# EAGLE design Digital_Output_C (EAGLE 9.5.1)
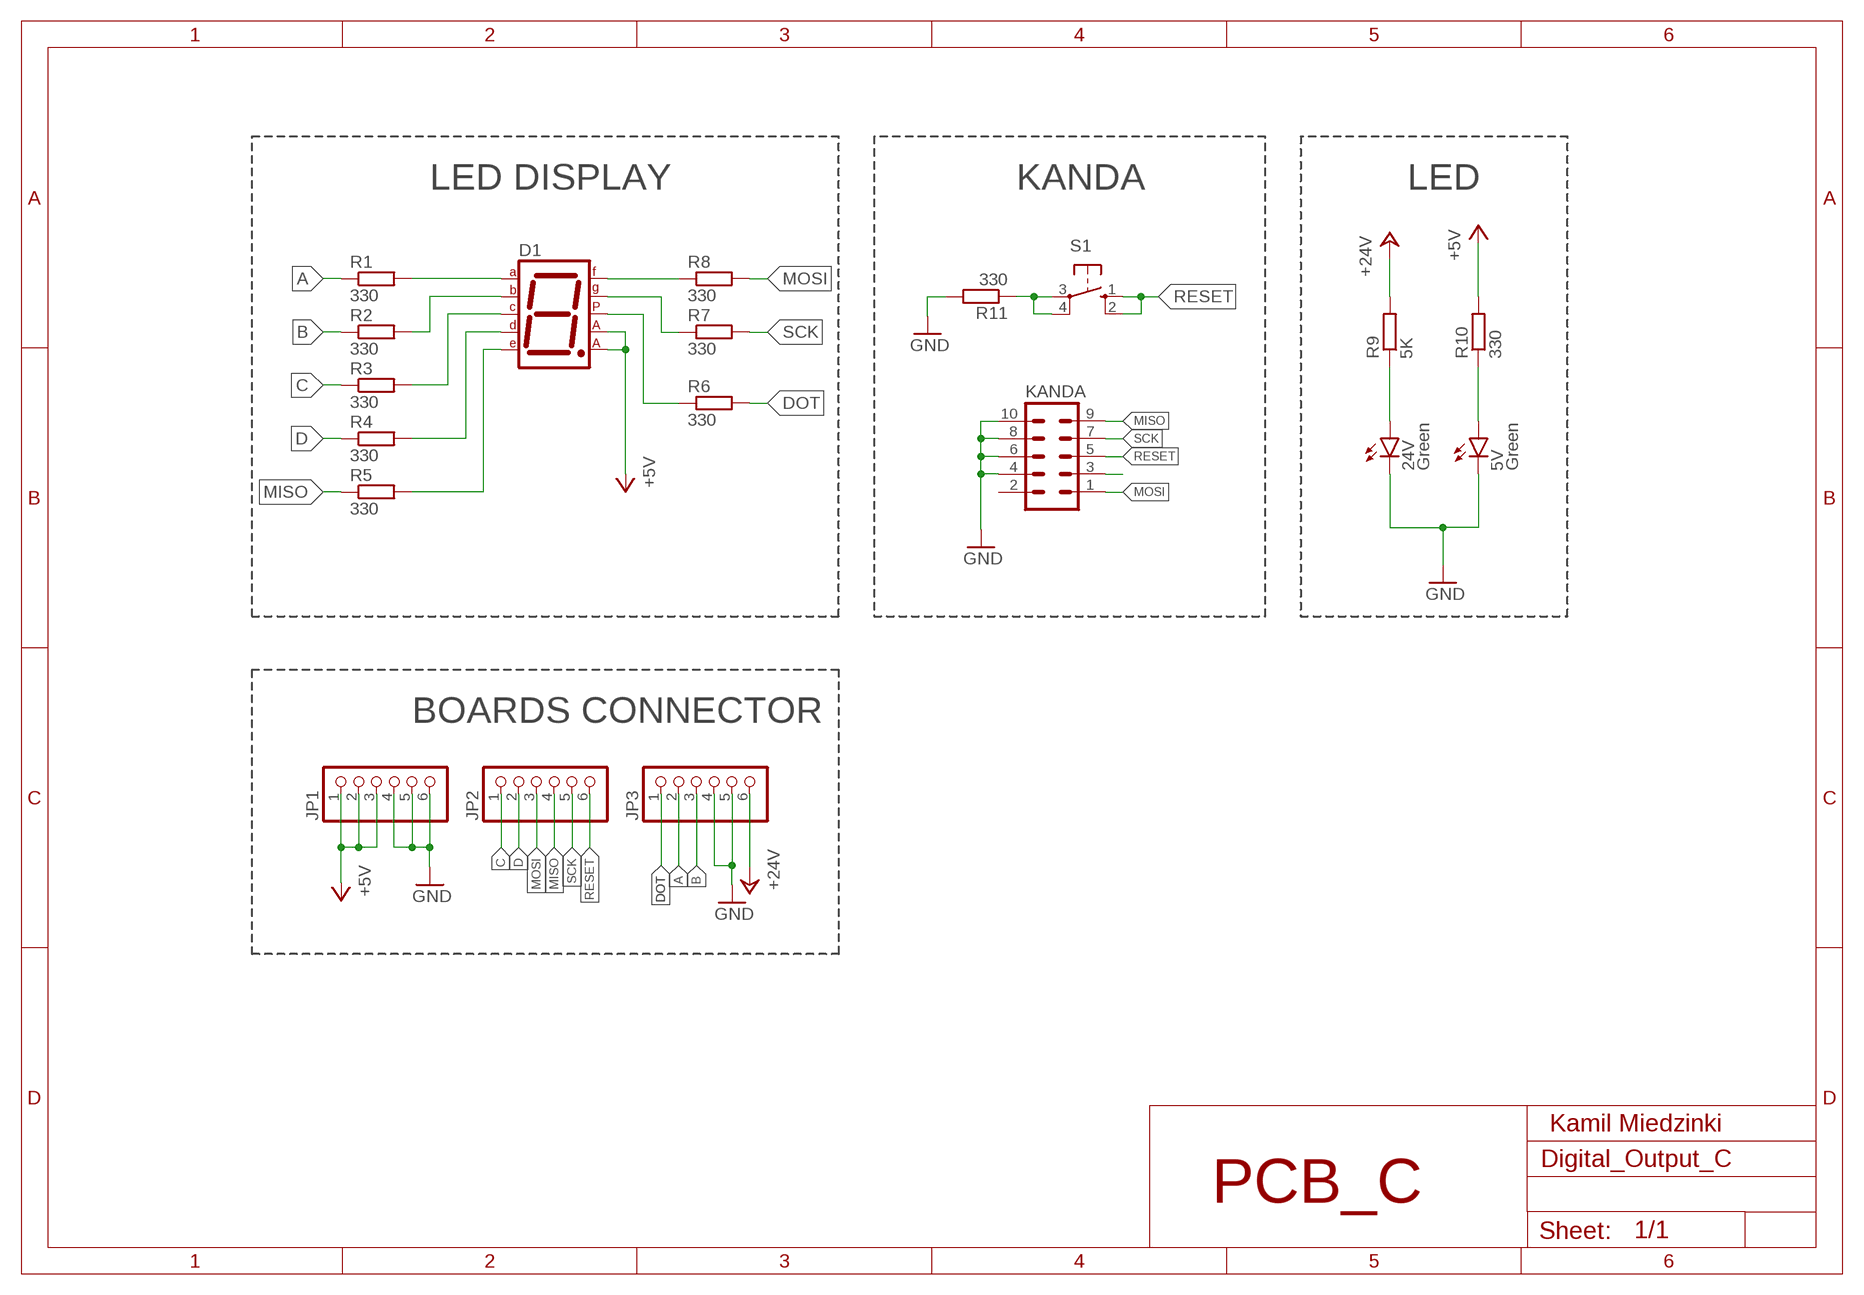
[diagram p0: schematic, sheet 1]

## Parts
5V  Green  LED5MM  [LED5MM]
24V  Green  LED5MM  [LED5MM]
D1  7SEG-CA  [7SEG-13]
JP1  PINHD-1X6"  [1X06H]
JP2  PINHD-1X6"  [1X06H]
JP3  PINHD-1X6"  [1X06H]
KANDA  ML10  [ML10]
R1  330  R-EU_R0805  [R0805]
R2  330  R-EU_R0805  [R0805]
R3  330  R-EU_R0805  [R0805]
R4  330  R-EU_R0805  [R0805]
R5  330  R-EU_R0805  [R0805]
R6  330  R-EU_R0805  [R0805]
R7  330  R-EU_R0805  [R0805]
R8  330  R-EU_R0805  [R0805]
R9  5K  R-EU_0207/7  [0207/7]
R10  330  R-EU_0207/7  [0207/7]
R11  330  R-EU_R0805  [R0805]
S1  10-XX  [B3F-10XX]

## Nets
+5V: D1.3(CA1) D1.8(CA2) JP1.1 JP1.2 JP1.3 R10.2
+24V: JP3.6 R9.2
A: JP3.2 R1.1
B: JP3.3 R2.1
C: JP2.1 R3.1
D: JP2.2 R4.1
DOT: JP3.1 R6.2
GND: 5V.K(C) 24V.K(C) JP1.4 JP1.5 JP1.6 JP3.4 JP3.5 KANDA.4 KANDA.6 KANDA.8 KANDA.10 R11.2
MISO: JP2.4 KANDA.9 R5.1
MOSI: JP2.3 KANDA.1 R8.2
N$2: R11.1 S1.3(P) S1.4(P1)
N$3: D1.7(A) R1.2
N$4: D1.6(B) R2.2
N$5: KANDA.3
N$6: D1.4(C) R3.2
N$7: D1.2(D) R4.2
N$8: D1.1(E) R5.2
N$9: D1.9(F) R8.1
N$10: D1.10(G) R7.1
N$11: D1.5(DP) R6.1
N$14: 24V.A R9.1
N$15: 5V.A R10.1
RESET: JP2.6 KANDA.5 S1.1(S) S1.2(S1)
SCK: JP2.5 KANDA.7 R7.2
Unconnected: KANDA.2

## Notes on the sheet
- LED DISPLAY | KANDA | LED
- BOARDS CONNECTOR
- Kamil Miedzinki
- PCB_C

## Library data of the parts
5V 24V = led:LED: LED OSRAM: - CHIPLED LG R971, LG N971, LY N971, LG Q971, LY Q971, LO R971, LY R971 LH N974, LH R974 LS Q976, LO Q976, LY Q976 LO Q996 - Hyper CHIPLED LW Q18S LB Q993, LB Q99A, LB R99A - SideLED LS A670, LO A670, LY A670, LG A670, LP A670 LB A673, LV A673, LT A673, LW A673 LH A674 LY A675 LS A676, LA A676, LO A676, LY A676, LW A676 LS A679, LY A679, LG A679 - Hyper Micro SIDELED® LS Y876, LA Y876, LO Y876, LY Y876 LT Y87S - SmartLED LW L88C, LW L88S LB L89C, LB L89S, LG L890 LS L89K, LO L89K, LY L89K LS L896, LA L896, LO L896, LY L896 - TOPLED LS T670, LO T670, LY T670, LG T670, LP T670 LSG T670, LSP T670, LSY T670, LOP T670, LYG T670 LG T671, LOG T671, LSG T671 LB T673, LV T673, LT T673, LW T673 LH T674 LS T676, LA T676, LO T676, LY T676, LB T676, LH T676, LSB T676, LW T676 LB T67C, LV T67C, LT T67C, LS T67K, LO T67K, LY T67K, LW E67C LS E67B, LA E67B, LO E67B, LY E67B, LB E67C, LV E67C, LT E67C LW T67C LS T679, LY T679, LG T679 LS T770, LO T770, LY T770, LG T770, LP T770 LB T773, LV T773, LT T773, LW T773 LH T774 LS E675, LA E675, LY E675, LS T675 LS T776, LA T776, LO T776, LY T776, LB T776 LHGB T686 LT T68C, LB T68C - Hyper Mini TOPLED® LB M676 - Mini TOPLED Santana® LG M470 LS M47K, LO M47K, LY M47K Source: http://www.osram.convergy.de LUXEON: - LUMILED® LXK2-PW12-R00, LXK2-PW12-S00, LXK2-PW14-U00, LXK2-PW14-V00 LXK2-PM12-R00, LXK2-PM12-S00, LXK2-PM14-U00 LXK2-PE12-Q00, LXK2-PE12-R00, LXK2-PE12-S00, LXK2-PE14-T00, LXK2-PE14-U00 LXK2-PB12-K00, LXK2-PB12-L00, LXK2-PB12-M00, LXK2-PB14-N00, LXK2-PB14-P00, LXK2-PB14-Q00 LXK2-PR12-L00, LXK2-PR12-M00, LXK2-PR14-Q00, LXK2-PR14-R00 LXK2-PD12-Q00, LXK2-PD12-R00, LXK2-PD12-S00 LXK2-PH12-R00, LXK2-PH12-S00 LXK2-PL12-P00, LXK2-PL12-Q00, LXK2-PL12-R00 Source: www.luxeon.com KINGBRIGHT: KA-3528ASYC Source: www.kingbright.com
D1 = special:7SEG-CA: 7-segment DISPLAY single anode, 13 mm
JP1-JP3 = pinhead:PINHD-1X6: PIN HEADER
KANDA = con-harting-ml:ML10: HARTING; OC_FARNELL: unknown; OC_NEWARK: unknown
R1-R11 = rcl:R-EU_: RESISTOR, European symbol; SPICEPREFIX: R
S1 = switch-omron:10-XX: OMRON SWITCH; MPN: B3F-1000; OC_FARNELL: 176432; OC_NEWARK: 36M3542

## Board
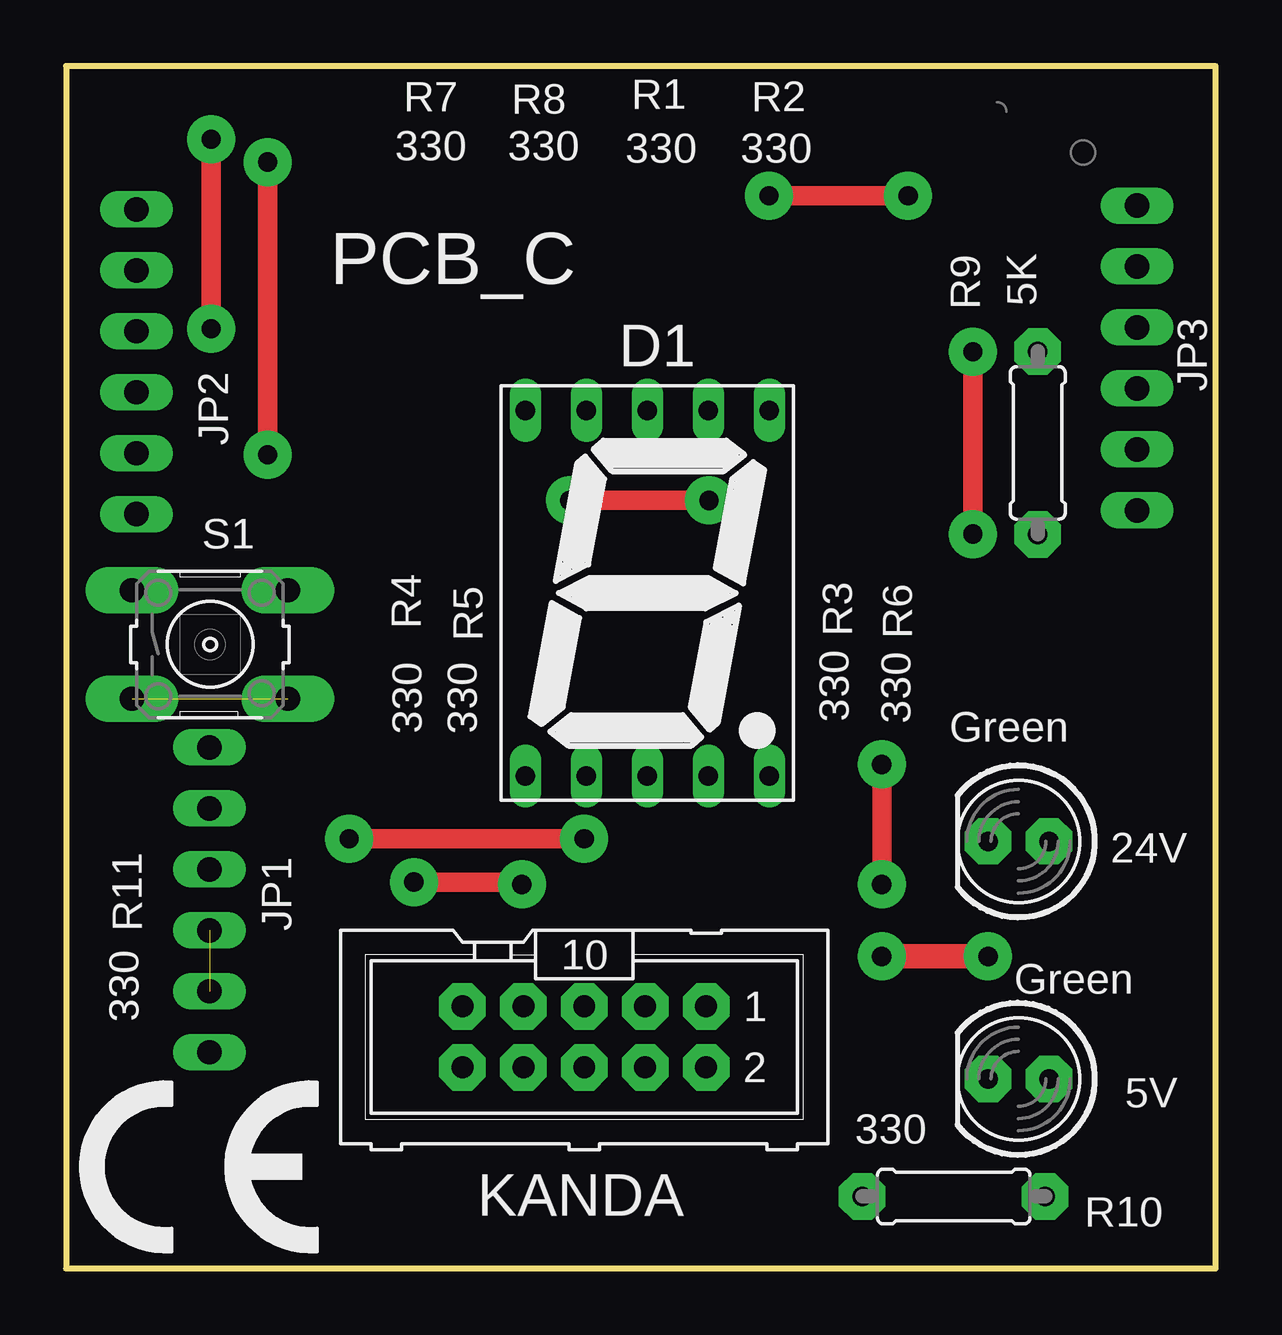
[diagram p1: board, top side]
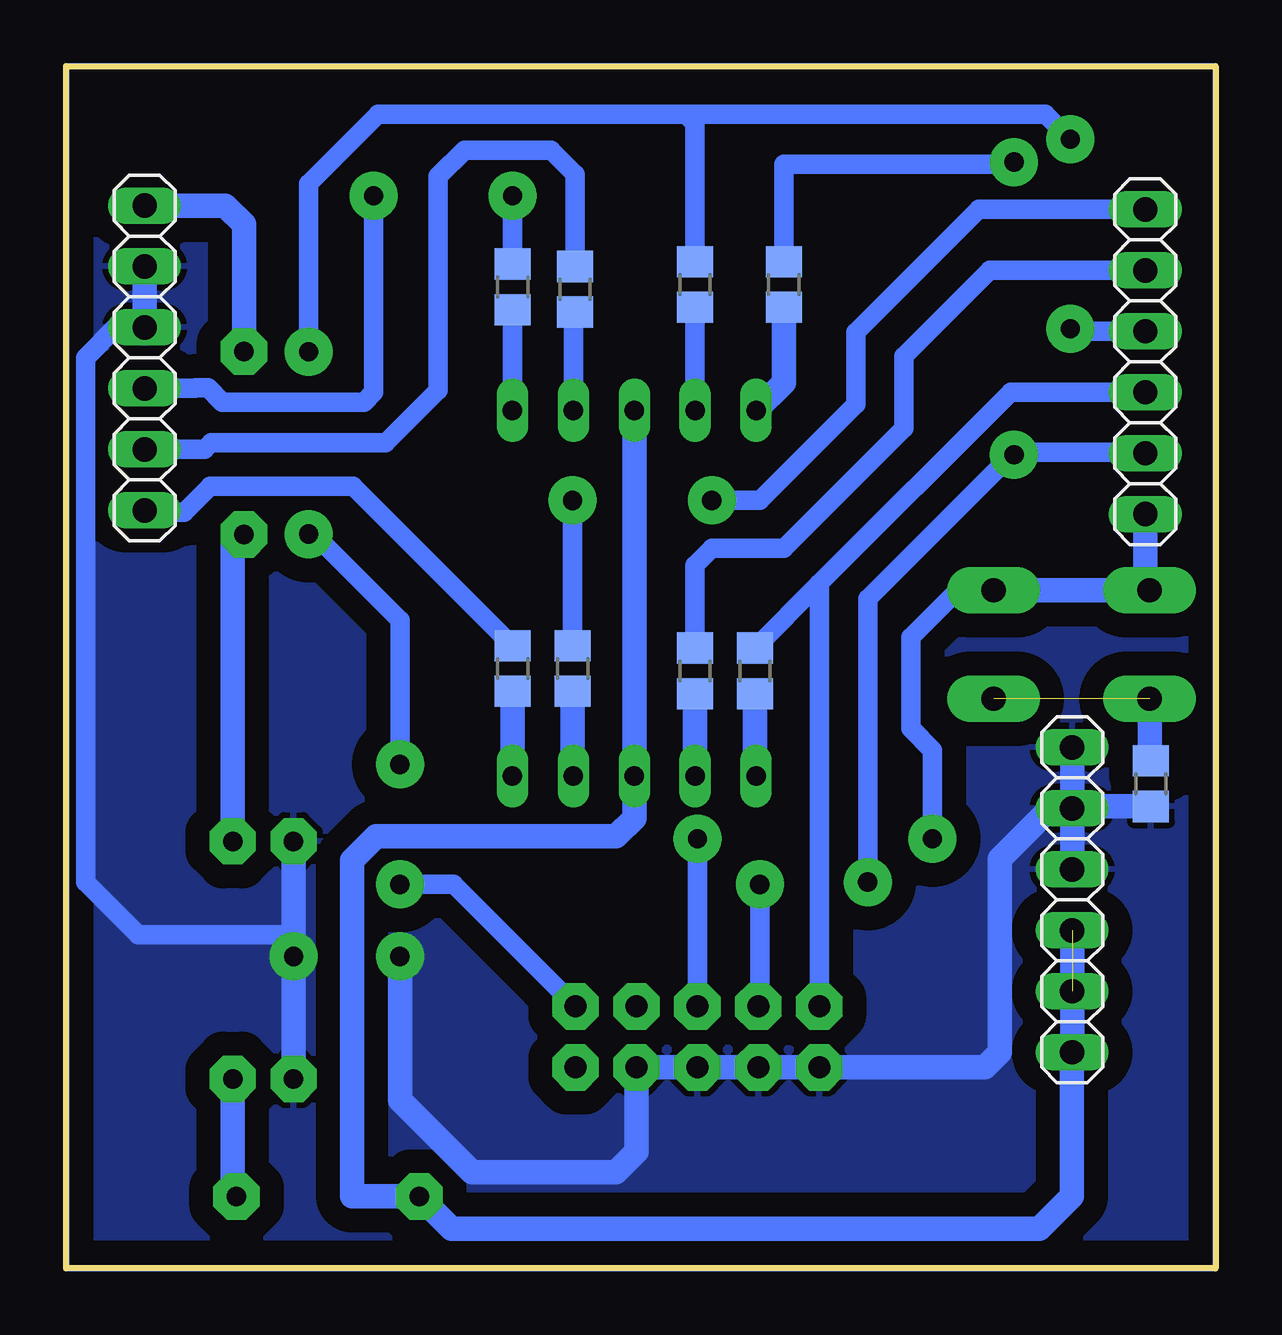
[diagram p2: board, bottom side, seen from below]

Size 47.91 x 50.1 mm. Coordinates in mm from the lower left corner, seen from the top.
Outline: 0,50.1 0,0 47.91,0 47.91,50.1 0,50.1
Copper layers (1*16): Top 0.035mm / dielectric 1.5mm / Bottom 0.035mm
Design rules "default": minimum track width 6mil, minimum drill 0.35mm, track to track 6mil, track to pad 6mil, pad to pad 6mil, via to via 6mil, smd to smd 6mil, copper to edge 40mil, drill to drill 6mil, minimum pad ring 10mil, minimum via ring 8mil, stop-mask expansion 4mil, vias tented up to drill 0mil, thermal gap 10mil

### Footprints (pad centres in the part's own frame; a part is rotated, then mirrored left to right if it is on the bottom)
LED5MM = drill 0.813 pad 1.93 octagon: A -1.27,0; K 1.27,0
7SEG-13 = drill 0.813 long: 1 -5.08,-7.62; 2 -2.54,-7.62; 3 0,-7.62; 4 2.54,-7.62; 5 5.08,-7.62; 6 5.08,7.62; 7 2.54,7.62; 8 0,7.62; 9 -2.54,7.62; 10 -5.08,7.62
1X06H = drill 1.016 long: 1 -6.35,0; 2 -3.81,0; 3 -1.27,0; 4 1.27,0; 5 3.81,0; 6 6.35,0
ML10 = drill 0.914 pad 1.93 octagon: 1 -5.08,-1.27; 2 -5.08,1.27; 3 -2.54,-1.27; 4 -2.54,1.27; 5 0,-1.27; 6 0,1.27; 7 2.54,-1.27; 8 2.54,1.27; 9 5.08,-1.27; 10 5.08,1.27
R0805 = smd 1.3 x 1.5: 1 -0.95,0; 2 0.95,0
0207/7 = drill 0.813 pad 1.93 octagon: 1 -3.81,0; 2 3.81,0
B3F-10XX = drill 1.016 pad 1.93 long: 1 -3.251,2.261; 2 3.251,2.261; 3 -3.251,-2.261; 4 3.251,-2.261

### Placement (x,y rotation side)
5V  39.7,7.9 180 top
24V  39.7,17.8 180 top
D1  24.23,28.14 0 top
JP1  5.98,15.36 90 bottom
JP2  2.93,37.78 270 bottom
JP3  44.64,37.94 90 bottom
KANDA  21.6,9.65 180 top
R1  26.7,40.8 270 bottom
R2  29.3,40.9 270 bottom
R3  26.8,25 270 bottom
R4  21.7,24.9 270 bottom
R5  19.2,24.9 270 bottom
R6  29.3,25 90 bottom
R7  18,41 90 bottom
R8  21.7,41 90 bottom
R9  40.5,34.4 90 top
R10  37,3 180 top
R11  2.7,20.2 270 bottom
S1  6,26 0 top
U$1  [CE_7.3MM]  0.5,0.6 0 top
U$2  [LOGO]  35,46 0 top

### Tracks (layer width: path | path; a pad name or v marks a point on that pad's centre or on a via)
+5V  (1 unrouted)
  Bottom 1.016: JP1.3 JP1.1 6,8.99 6,3 7.35,1.65 31.84,1.65 R10.2 36,3 36,17 35,18 25,18 24.23,18.77 D1.3 D1.8
+24V
  Bottom 1.016: R9.2 40.5,43.5 41.29,44.29 JP3.6
A
  Bottom 0.813: JP3.2 42.14,34.13 41.87,34.4 34.6,34.4 32.4,36.6 32.4,45.5 31.3,46.6 27.7,46.6 26.7,45.6 R1.1
B  (via drill 0.8 pad 2)
  Top 0.813: v35.1,44.7 v29.3,44.7
  Bottom 0.813: JP3.3 42.53,36.67 42.5,36.7 42,36.7 41.4,36.1 35.5,36.1 35.1,36.5 v35.1,44.7 | v29.3,44.7 R2.1
C  (via drill 0.8 pad 2)
  Top 0.813: v21,32 v26.8,32
  Bottom 0.813: JP2.1 9.87,44.13 15,39 15,36 19,32 v21,32 | v26.8,32 R3.1
D
  Bottom 0.813: R4.1 21.7,29.3 21,30 18,30 13,35 13,38 9.41,41.59 JP2.2
DOT
  Bottom 0.813: R6.2 35.95,32.6 41.9,32.6 43,31.5 44.55,31.5 JP3.1
GND  (via drill 0.8 pad 2)
  Top 1.016: v38.43,13 v34,13
  Bottom 0.254: 47.91,0 0,0 0,50.1 47.91,50.1 47.91,0
  Bottom 0.508: JP3.4 45.61,39.21
  Bottom 0.813: 7.06,19 5.98,19 | JP3.4 45.84,39.21 47.1,37.95 47.1,16.1 44.9,13.9 38.43,13.9
  Bottom 1.016: R11.2 5.9,19.25 JP1.5 | JP1.6 5.98,19 JP1.4 | 5V.K v38.43,13 | v38.43,13 38.43,13.9 | 24V.K 38.43,15 v38.43,13 | JP3.5 JP3.4 | 7.06,19 9,17.06 9,9 9.62,8.38 KANDA.10 KANDA.4 24.14,4.86 25,4 31,4 34,7 v34,13
  pour Bottom (isolate 1): 47.91,0 0,0 0,50.1 47.91,50.1
MISO
  Bottom 0.813: R5.1 16.52,28.52 | 16.52,28.52 8.54,36.51 JP2.4 | KANDA.9 16.52,28.52
MOSI  (via drill 0.8 pad 2)
  Top 0.813: v34,16 v34,21 | v37.8,30.6 v37.8,38.2 | v6.05,39.15 6.05,46.95 6,47 v6.05,47.05
  Bottom 0.813: KANDA.1 31.76,16 v34,16 | v34,21 34,27 37.5,30.5 37.7,30.5 v37.8,30.6 | v37.8,38.2 37.8,45.2 34.9,48.1 22.1,48.1 | JP2.3 6.05,39.05 6.1,39.1 v6.05,39.15 | v6.05,47.05 7.1,48.1 22.1,48.1 | 22.1,48.1 21.7,47.7 R8.2
N$2  (1 unrouted)
  Bottom 1.016: S1.3 2.75,21.2 R11.1
N$3
  Bottom 0.813: R1.2 26.77,39.78 D1.7
N$4
  Bottom 0.813: R2.2 D1.6
N$6
  Bottom 1.016: R3.2 26.8,20.55 D1.4
N$7
  Bottom 1.016: R4.2 D1.2
N$8
  Bottom 1.016: R5.2 19.2,20.57 D1.1
N$9
  Bottom 0.813: R8.1 D1.9
N$10
  Bottom 1.016: D1.10 18,36.91 R7.1
N$11
  Bottom 1.016: R6.1 D1.5
N$14
  Bottom 1.016: 24V.A 40.97,30.12 R9.1
N$15
  Bottom 1.016: R10.1 40.97,3.16 5V.A
RESET  (via drill 0.8 pad 2)
  Top 0.813: v21.6,17.9 v11.8,17.9
  Bottom 0.813: KANDA.5 v21.6,17.9 | v11.8,17.9 11.8,21.6 12.7,22.5 12.7,26.3 10.74,28.26 S1.2
  Bottom 1.016: JP2.6 2.93,28.44 S1.1 S1.2
SCK  (via drill 0.8 pad 2)
  Top 0.813: v8.4,33.9 v8.4,46.1 | v14.5,16.1 18.9,16.1 v19,16
  Bottom 0.813: JP2.5 2.96,34 8.4,34 v8.4,33.9 8.5,33.9 14.5,27.9 v14.5,16.1 | R7.2 18,46 8.5,46 v8.4,46.1 | v19,16 19,10.98 KANDA.7

### Text on the board
tNames: PCB_C